# EAGLE schematic RTC_pm (EAGLE 6.1)
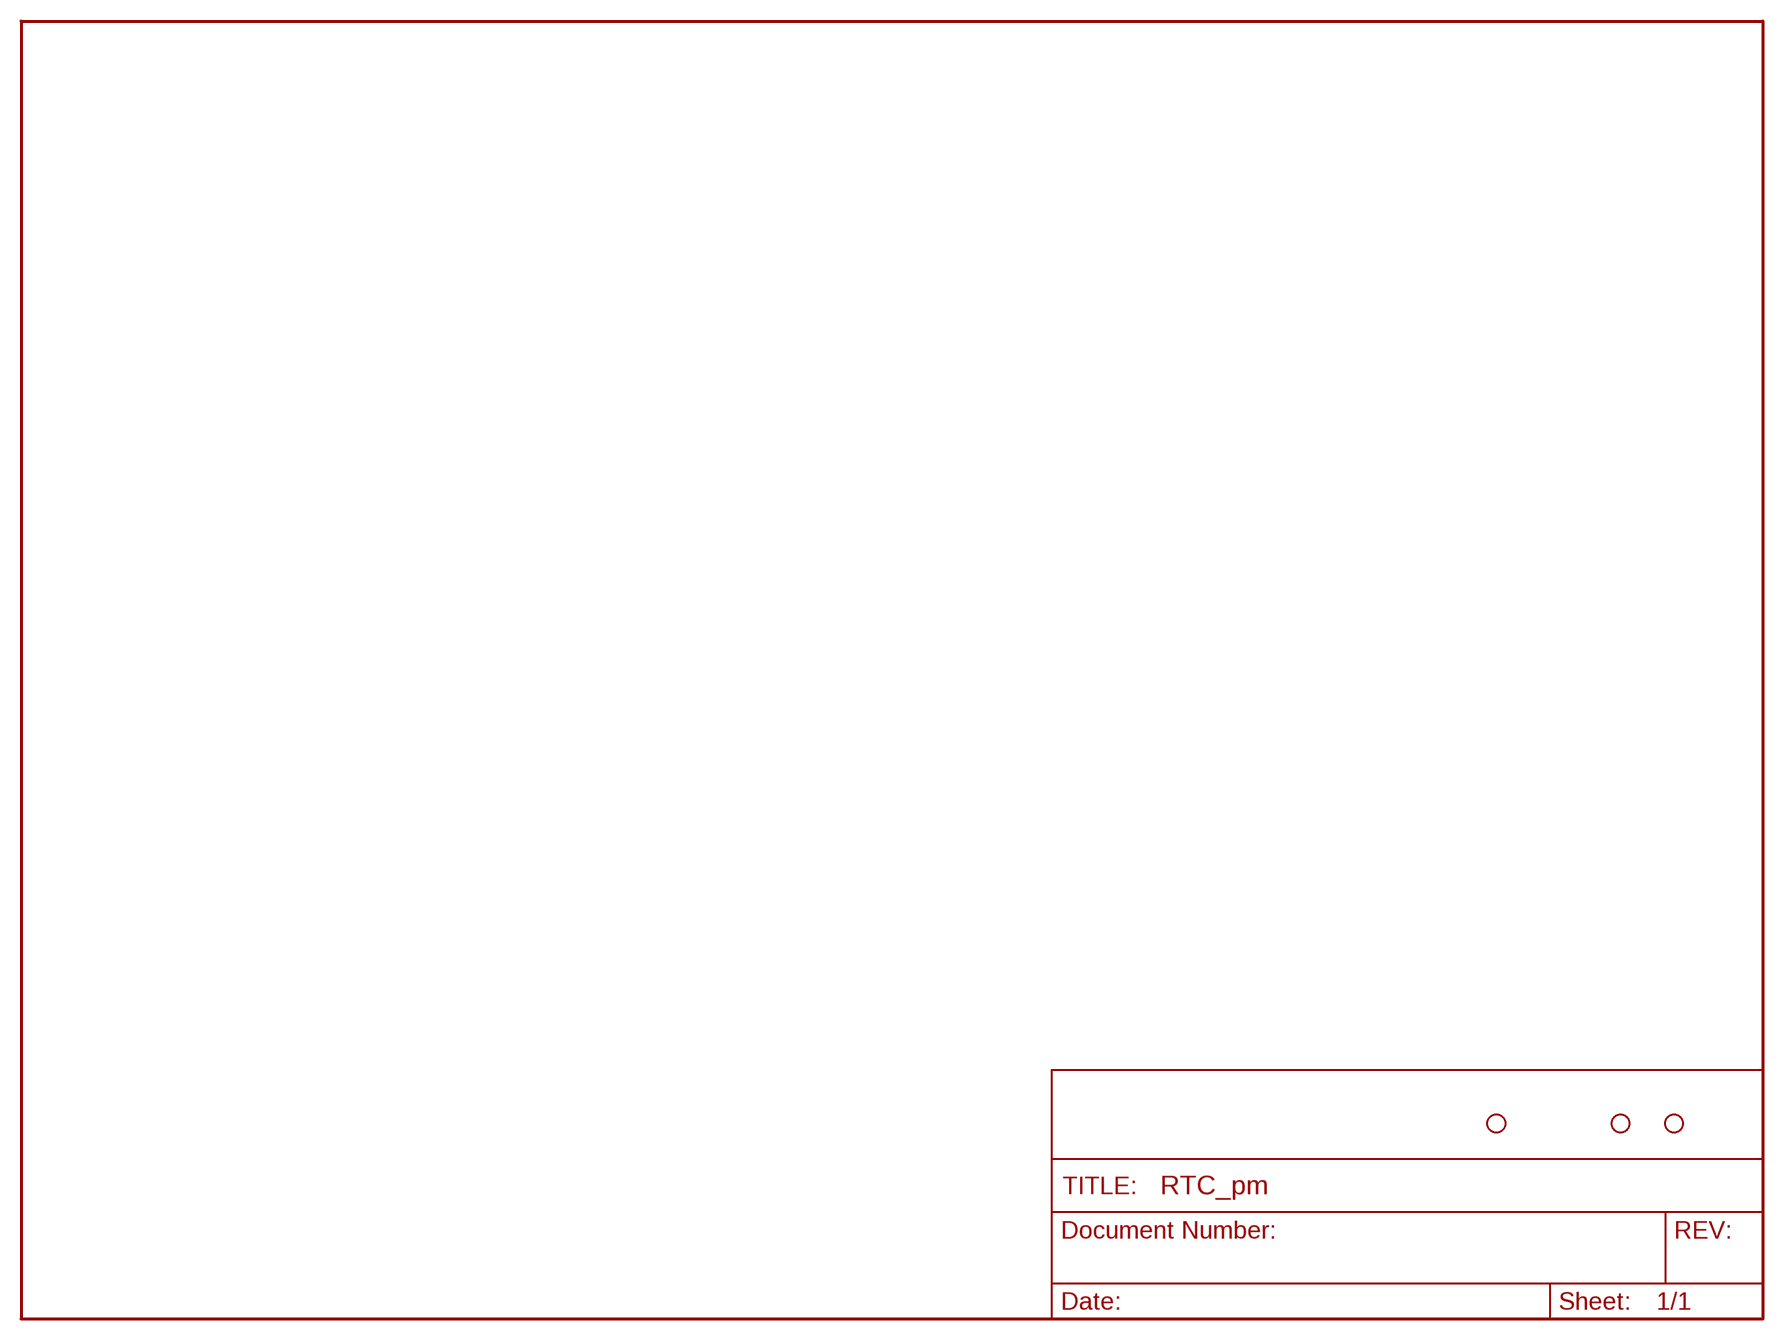
[diagram p0: schematic, sheet 1]

## Parts
JP7  STAND-OFFTIGHT  [STAND-OFF-TIGHT]
JP9  STAND-OFFTIGHT  [STAND-OFF-TIGHT]
JP10  STAND-OFFTIGHT  [STAND-OFF-TIGHT]

## Library data of the parts
JP7 JP9 JP10 = SparkFun:STAND-OFF: Stand Off This is the mechanical footprint for a #4 phillips button head screw. Use the keepout ring to avoid running the screw head into surrounding components. SKU : PRT-00447